# Altium project STM32F405_KIT.PrjPcb
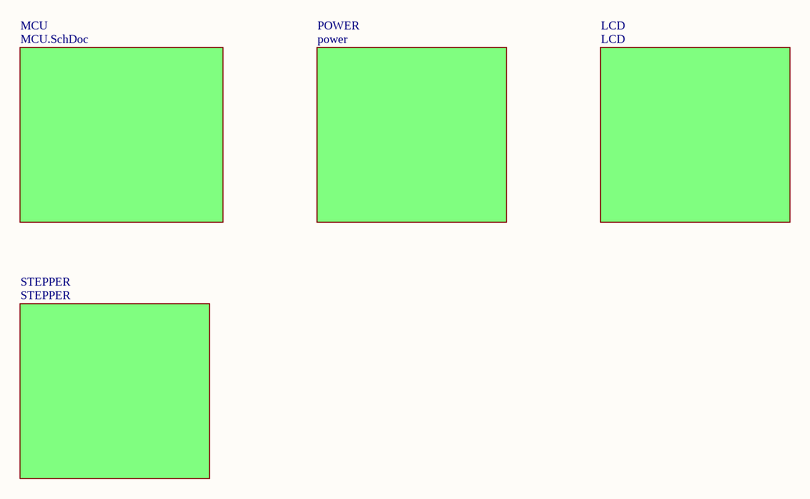
[diagram p0: MAIN.SchDoc]
4 sheets, 70 parts. Net scope: flat (ports and power ports of the same name join across sheets).
Board file: Board.PcbDoc
Sheets:
  MAIN.SchDoc
    MCU = MCU.SchDoc
    POWER = power.SchDoc
    STEPPER = STEPPER.SchDoc

## Sheet MAIN.SchDoc
size A

### Sub-sheets
LCD = LCD (file not in this document): no entries
MCU = MCU.SchDoc: no entries
POWER = power: no entries
STEPPER = STEPPER: no entries

## Sheet MCU.SchDoc
size A
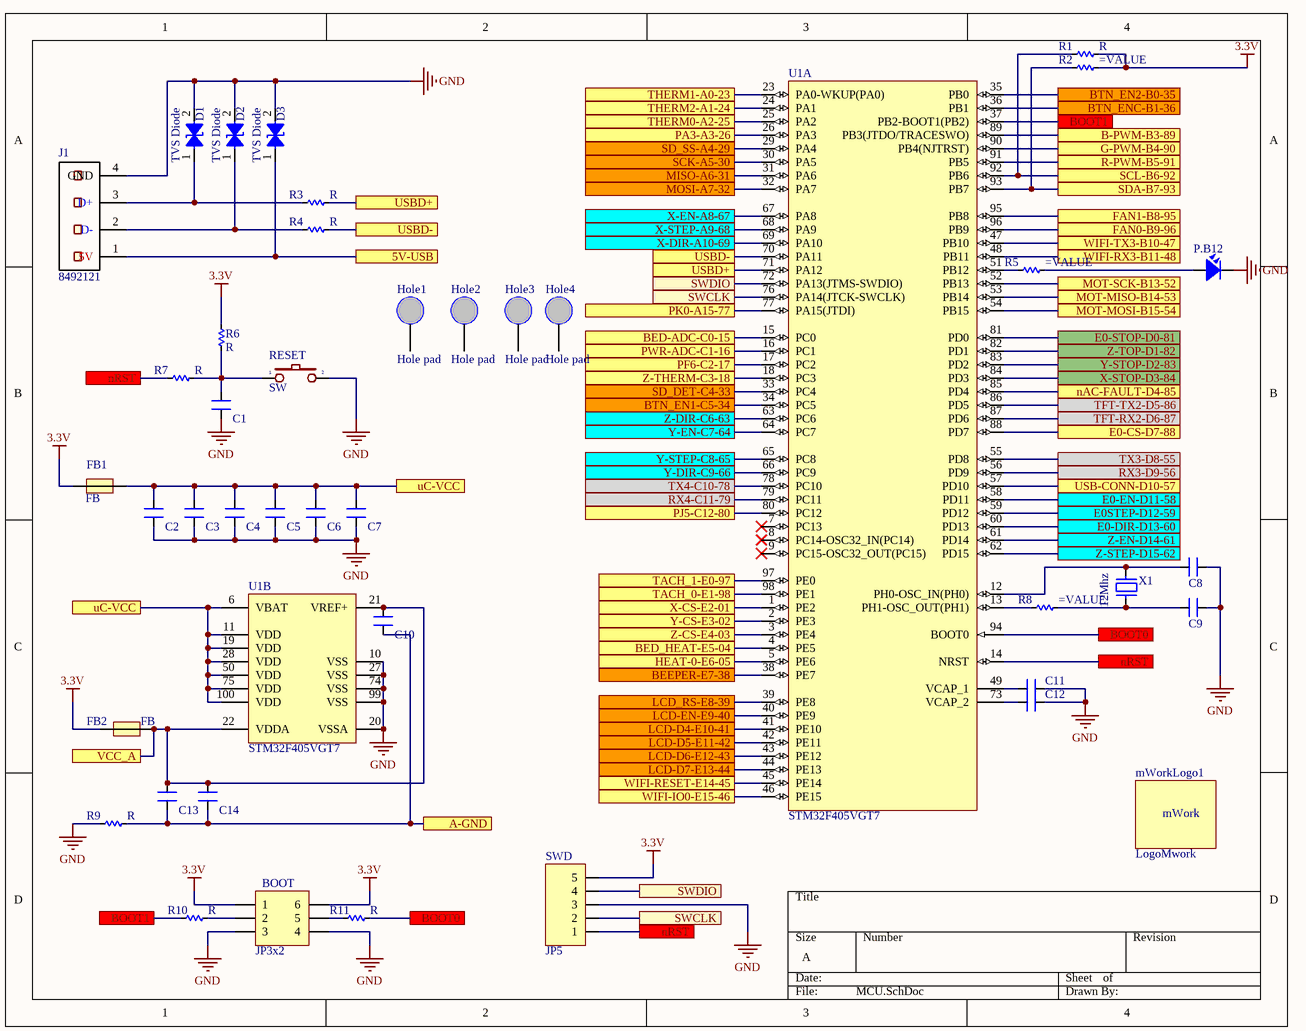
[diagram p1: MCU.SchDoc]

### Parts
BOOT  JP3x2  [JP3-D2T]
C1  CN  [CN-SMD-0603_big]  (value not drawn)
C2  CN  [CN-SMD-0603_big]  (value not drawn)
C3  CN  [CN-SMD-0603_big]  (value not drawn)
C4  CN  [CN-SMD-0603_big]  (value not drawn)
C5  CN  [CN-SMD-0603_big]  (value not drawn)
C6  CN  [CN-SMD-0603_big]  (value not drawn)
C7  CN  [CN-SMD-0603_big]  (value not drawn)
C8  CN  [CN-SMD-0603_big]  (value not drawn)
C9  CN  [CN-SMD-0603_big]  (value not drawn)
C10  CN  [CN-SMD-0603_big]  (value not drawn)
C11  CN  [CN-SMD-0603_big]  (value not drawn)
C12  CN  [CN-SMD-0603_big]  (value not drawn)
C13  CN  [CN-SMD-0603_big]  (value not drawn)
C14  CN  [CN-SMD-0603_big]  (value not drawn)
D1  TVS Diode  [DIO-SMD-214AC]
D2  TVS Diode  [DIO-SMD-214AC]
D3  TVS Diode  [DIO-SMD-214AC]
FB1  FB  [Capacitor_805]
FB2  FB  [Capacitor_805]
Hole1  Hole pad  [HolePad1]
Hole2  Hole pad  [HolePad1]
Hole3  Hole pad  [HolePad1]
Hole4  Hole pad  [HolePad1]
J1  8492121  [USB-C2]
mWorkLogo1  LogoMwork  [LogoMwork15*6]
P.B12  LED  [LED-RED-0805]  (value not drawn)
R1  R  [RES-SMD-0603_BIG]
R2  (no value)  [RES-SMD-0603_BIG]
R3  R  [RES-SMD-0603_BIG]
R4  R  [RES-SMD-0603_BIG]
R5  (no value)  [RES-SMD-0603_BIG]
R6  R  [RES-SMD-0603_BIG]
R7  R  [RES-SMD-0603_BIG]
R8  (no value)  [RES-SMD-0603_BIG]
R9  R  [RES-SMD-0603_BIG]
R10  R  [RES-SMD-0603_BIG]
R11  R  [RES-SMD-0603_BIG]
RESET  SW  [SW1-SMD]
SWD  JP5  [JP5-D1T]
U1  STM32F405VGT7  [STM-LQFP100_N]  (parts A,B of 2)
X1  12Mhz  [XT2]

### Ports
5V-USB, A-GND, B-PWM-B3-89, BED-ADC-C0-15, BED_HEAT-E5-04, BEEPER-E7-38, BOOT0, BOOT1, BTN_EN1-C5-34, BTN_EN2-B0-35, BTN_ENC-B1-36, E0-CS-D7-88, E0-DIR-D13-60, E0-EN-D11-58, E0-STOP-D0-81, E0STEP-D12-59, FAN0-B9-96, FAN1-B8-95, G-PWM-B4-90, HEAT-0-E6-05, LCD-D4-E10-41, LCD-D5-E11-42, LCD-D6-E12-43, LCD-D7-E13-44, LCD-EN-E9-40, LCD_RS-E8-39, MISO-A6-31, MOSI-A7-32, MOT-MISO-B14-53, MOT-MOSI-B15-54, MOT-SCK-B13-52, nAC-FAULT-D4-85, nRST, PA3-A3-26, PF6-C2-17, PJ5-C12-80, PK0-A15-77, PWR-ADC-C1-16, R-PWM-B5-91, RX3-D9-56, RX4-C11-79, SCK-A5-30, SCL-B6-92, SD_DET-C4-33, SD_SS-A4-29, SDA-B7-93, SWCLK, SWDIO, TACH_0-E1-98, TACH_1-E0-97, TFT-RX2-D6-87, TFT-TX2-D5-86, THERM0-A2-25, THERM1-A0-23, THERM2-A1-24, TX3-D8-55, TX4-C10-78, uC-VCC, USB-CONN-D10-57, USBD+, USBD-, VCC_A, WIFI-IO0-E15-46, WIFI-RESET-E14-45, WIFI-RX3-B11-48, WIFI-TX3-B10-47, X-CS-E2-01, X-DIR-A10-69, X-EN-A8-67, X-STEP-A9-68, X-STOP-D3-84, Y-CS-E3-02, Y-DIR-C9-66, Y-EN-C7-64, Y-STEP-C8-65, Y-STOP-D2-83, Z-CS-E4-03, Z-DIR-C6-63, Z-EN-D14-61, Z-STEP-D15-62, Z-THERM-C3-18, Z-TOP-D1-82

### Nets
3.3V: BOOT.1 BOOT.6 FB1.1 FB2.1 R1.2 R2.2 R6.1 SWD.5
GND: BOOT.3 BOOT.4 C1.1 C2.1 C3.1 C4.1 C5.1 C6.1 C7.1 C8.2 C9.2 C11.2 C12.2 D1.2(GND) D2.2(GND) D3.2(GND) J1.4(GND) P.B12.2 R9.2 RESET.2 SWD.3 U1.10(VSS) U1.20(VSSA) U1.27(VSS) U1.74(VSS) U1.99(VSS)
NetBOOT_2: BOOT.2 R10.1
NetBOOT_5: BOOT.5 R11.2
NetC1_2: C1.2 R6.2 R7.1 RESET.1
NetC2_2: C2.2 C3.2 C4.2 C5.2 C6.2 C7.2 FB1.2 U1.6(VBAT) U1.11(VDD) U1.19(VDD) U1.28(VDD) U1.50(VDD) U1.75(VDD) U1.100(VDD) ; port uC-VCC
NetC8_1: C8.1 U1.12(PH0-OSC_IN(PH0)) X1.2
NetC9_1: C9.1 R8.2 X1.1
NetC10_1: C10.1 C13.1 C14.1 R9.1 ; port A-GND
NetC10_2: C10.2 C13.2 C14.2 FB2.2 U1.21(VREF+) U1.22(VDDA) ; port VCC_A
NetC11_1: C11.1 U1.49(VCAP_1)
NetC12_1: C12.1 U1.73(VCAP_2)
NetC21_3: R7.2 SWD.1 U1.14(NRST) ; port nRST
NetC21_4: U1.78(PC10) ; port TX4-C10-78
NetC21_5: U1.80(PC12) ; port PJ5-C12-80
NetC21_6: U1.82(PD1) ; port Z-TOP-D1-82
NetC21_7: U1.84(PD3) ; port X-STOP-D3-84
NetC21_8: U1.86(PD5) ; port TFT-TX2-D5-86
NetC21_9: U1.88(PD7) ; port E0-CS-D7-88
NetC21_10: U1.90(PB4(NJTRST)) ; port G-PWM-B4-90
NetC21_11: R1.1 U1.92(PB6) ; port SCL-B6-92
NetC21_13: U1.96(PB9) ; port FAN0-B9-96
NetC21_14: U1.98(PE1) ; port TACH_0-E1-98
NetC21_15: U1.2(PE3) ; port Y-CS-E3-02
NetC21_16: U1.4(PE5) ; port BED_HEAT-E5-04
NetC21_18: U1.16(PC1) ; port PWR-ADC-C1-16
NetC21_19: U1.18(PC3) ; port Z-THERM-C3-18
NetC21_21: U1.24(PA1) ; port THERM2-A1-24
NetC21_22: U1.26(PA3) ; port PA3-A3-26
NetC21_23: U1.25(PA2) ; port THERM0-A2-25
NetC21_24: U1.23(PA0-WKUP(PA0)) ; port THERM1-A0-23
NetC21_26: U1.17(PC2) ; port PF6-C2-17
NetC21_27: U1.15(PC0) ; port BED-ADC-C0-15
NetC21_28: U1.5(PE6) ; port HEAT-0-E6-05
NetC21_29: U1.3(PE4) ; port Z-CS-E4-03
NetC21_30: U1.1(PE2) ; port X-CS-E2-01
NetC21_31: U1.97(PE0) ; port TACH_1-E0-97
NetC21_32: U1.95(PB8) ; port FAN1-B8-95
NetC21_33: R2.1 U1.93(PB7) ; port SDA-B7-93
NetC21_34: U1.91(PB5) ; port R-PWM-B5-91
NetC21_35: U1.89(PB3(JTDO/TRACESWO)) ; port B-PWM-B3-89
NetC21_36: U1.87(PD6) ; port TFT-RX2-D6-87
NetC21_37: U1.85(PD4) ; port nAC-FAULT-D4-85
NetC21_38: U1.83(PD2) ; port Y-STOP-D2-83
NetC21_39: U1.81(PD0) ; port E0-STOP-D0-81
NetC21_40: U1.79(PC11) ; port RX4-C11-79
NetC21_41: U1.77(PA15(JTDI)) ; port PK0-A15-77
NetC22_3: U1.68(PA9) ; port X-STEP-A9-68
NetC22_4: U1.66(PC9) ; port Y-DIR-C9-66
NetC22_5: U1.64(PC7) ; port Y-EN-C7-64
NetC22_6: U1.62(PD15) ; port Z-STEP-D15-62
NetC22_7: U1.60(PD13) ; port E0-DIR-D13-60
NetC22_8: U1.58(PD11) ; port E0-EN-D11-58
NetC22_9: U1.56(PD9) ; port RX3-D9-56
NetC22_10: U1.54(PB15) ; port MOT-MOSI-B15-54
NetC22_11: U1.52(PB13) ; port MOT-SCK-B13-52
NetC22_12: U1.47(PB10) ; port WIFI-TX3-B10-47
NetC22_13: U1.45(PE14) ; port WIFI-RESET-E14-45
NetC22_16: U1.43(PE12) ; port LCD-D6-E12-43
NetC22_17: U1.41(PE10) ; port LCD-D4-E10-41
NetC22_18: U1.39(PE8) ; port LCD_RS-E8-39
NetC22_19: U1.36(PB1) ; port BTN_ENC-B1-36
NetC22_20: U1.34(PC5) ; port BTN_EN1-C5-34
NetC22_21: U1.32(PA7) ; port MOSI-A7-32
NetC22_22: U1.30(PA5) ; port SCK-A5-30
NetC22_23: U1.29(PA4) ; port SD_SS-A4-29
NetC22_24: U1.31(PA6) ; port MISO-A6-31
NetC22_25: U1.33(PC4) ; port SD_DET-C4-33
NetC22_26: U1.35(PB0) ; port BTN_EN2-B0-35
NetC22_27: U1.38(PE7) ; port BEEPER-E7-38
NetC22_28: U1.40(PE9) ; port LCD-EN-E9-40
NetC22_29: U1.42(PE11) ; port LCD-D5-E11-42
NetC22_30: U1.44(PE13) ; port LCD-D7-E13-44
NetC22_32: U1.46(PE15) ; port WIFI-IO0-E15-46
NetC22_33: U1.48(PB11) ; port WIFI-RX3-B11-48
NetC22_34: U1.53(PB14) ; port MOT-MISO-B14-53
NetC22_35: U1.55(PD8) ; port TX3-D8-55
NetC22_36: U1.57(PD10) ; port USB-CONN-D10-57
NetC22_37: U1.59(PD12) ; port E0STEP-D12-59
NetC22_38: U1.61(PD14) ; port Z-EN-D14-61
NetC22_39: U1.63(PC6) ; port Z-DIR-C6-63
NetC22_40: U1.65(PC8) ; port Y-STEP-C8-65
NetC22_41: U1.67(PA8) ; port X-EN-A8-67
NetC22_42: U1.69(PA10) ; port X-DIR-A10-69
NetD1_1: D1.1(I/O_1) J1.3(D+) R3.2
NetD2_1: D2.1(I/O_1) J1.2(D-) R4.2
NetD3_1: D3.1(I/O_1) J1.1(5V) ; port 5V-USB
NetP.B12_1: P.B12.1 R5.2
NetR3_1: R3.1 U1.71(PA12) ; port USBD+
NetR4_1: R4.1 U1.70(PA11) ; port USBD-
NetR5_1: R5.1 U1.51(PB12)
NetR8_1: R8.1 U1.13(PH1-OSC_OUT(PH1))
NetR10_2: R10.2 U1.37(PB2-BOOT1(PB2)) ; port BOOT1
NetR11_1: R11.1 U1.94(BOOT0) ; port BOOT0
NetSWD_2: SWD.2 U1.76(PA14(JTCK-SWCLK)) ; port SWCLK
NetSWD_4: SWD.4 U1.72(PA13(JTMS-SWDIO)) ; port SWDIO

Not connected (* = marked no-connect by the designer): Hole1 1; Hole2 1; Hole3 1; Hole4 1; U1 7(PC13)* 8(PC14-OSC32_IN(PC14))* 9(PC15-OSC32_OUT(PC15))*

### Notes on the sheet
- (in symbol LogoMwork) mWork

### Library data of the parts
BOOT = JP3x2: WR-PHD 2.54 mm Dual Socket Header; Manufacturer: W¨¹rth Elektronik eiSos GmbH; partNo: 61300621821; ComponentLink1 Description: Manufacturer; ComponentLink2 Description: Datasheet; NoPins: 06; Created Date: 29 March 2013; ComponentLink1URL: http://www.we-online.com; ComponentLink2URL: http://katalog.we-online.de/em/datasheet/6130xx21821.pdf; Created by: Karrer Zheng
C1-C14 = CN: Value: 33pF
D1-D3 = TVS Diode: SMAJ5.0A
J1 = USB-4: THT USB 2.0 A Connector WE-EPLE; Manufacturer: Würth Elektronik eiSos GmbH; PartNo: 8492121; ComponentLink1Description: Manufacturer; ComponentLink1URL: http://www.we-online.de; Created by: Christin Otto; Created Date: OCT-2014; ComponentLink2Description: Datasheet; ComponentLink2URL: http://www.we-online.de/katalog/media/pdf/8492121.pdf
P.B12 = LED SMD: Value: LED 3 - 5 ly 2 Colour
R2 R5 R8 = R: Parameter 1: *
RESET = SW2: Switch button 2 pin; Value: SW chip 2 pin
SWD = JP5: WR-PHD 2.54 mm Angled Socket Header; Manufacturer: W¨¹rth Elektronik eiSos GmbH; partNo: 613005143121; ComponentLink1 Description: Manufacturer; ComponentLink2 Description: Datasheet; NoPins: 05; Created Date: 29 March 2013; ComponentLink1URL: http://www.we-online.com; ComponentLink2URL: http://katalog.we-online.de/em/datasheet/6130xx143121.pdf; Created by: Karrer Zheng
U1 = STM32F405VGT7: ARM Cortex-M4 32-bit MCU+FPU, 210 DMIPS, 1024 kB Flash, 192 kB Internal RAM, 82 I/Os, 100-pin LQFP, -40 to 105 degC, Tray; Manufacturer: STMicroelectronics; D/A Converter: 2x12-bit; FLASH Size (Prog) (kB): 1024; I/Os (High Current): 82; Internal RAM Size (kB): 192; Operating Frequency(F) (Processor speed) (MHz): 168; Supply Voltage(Vcc) max (V): 3.6; Supply Voltage(Vcc) min (V): 1.8; DatasheetVersion: Rev. 4; PackageVersion: Rev. 1, 06/2013; PackageReference: LQFP100; PackageDescription: 100-Pin Low Profile Quad Flat Package, 14 x 14 mm Body, 0.5 mm Pitch; Supplier 1: Newark; Supplier Part Number 1: 19X6225; Supplier 2: Mouser; Supplier Part Number 2: 511-STM32F405VGT7; Core: ARM Cortex-M4; Packing: Tray; Mounting Technology: Surface Mount; PartNumber: STM32F405VGT7; ComponentLink1Description: Manufacturer URL; ComponentLink1URL: http://www.st.com/web/en/home.html; ComponentLink2Description: Datasheet; ComponentLink2URL: http://www.st.com/st-web-ui/static/active/en/resource/technical/document/datasheet/DM00037051.pdf; ComponentLink3Description: Package Specification; ComponentLink3URL: http://www.st.com/st-web-ui/static/active/en/resource/technical/document/data_brief/DM00071938.pdf
X1 = XT2: Crystal, 32.768 KHz, -40 to 85 degC, 3.2 x 1.5 x 0.9 mm SMD; Value: 4Mhz

## Sheet power.SchDoc
size A
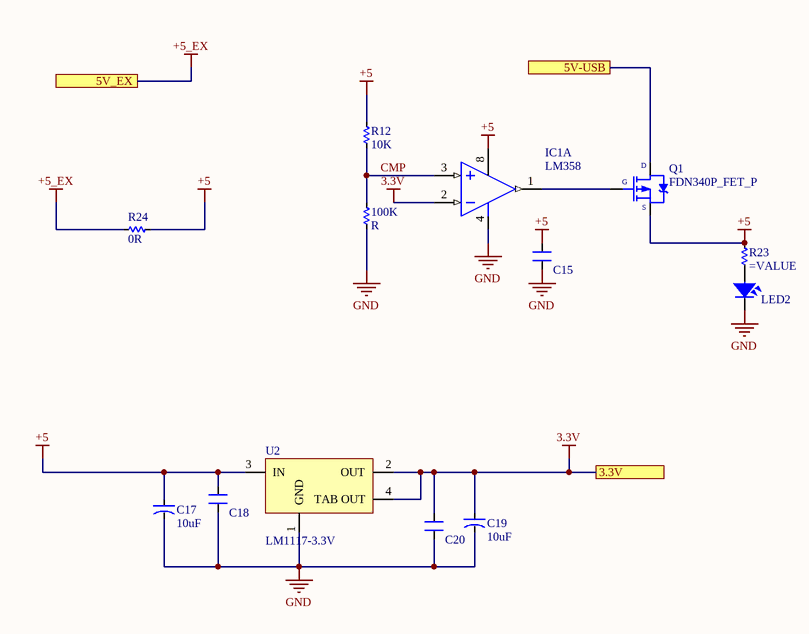
[diagram p2: power.SchDoc]

### Parts
100K  R  [RES-SMD-0603_BIG]
C15  CN  [CN-SMD-0603_big]  (value not drawn)
C17  10uF  [CAP-ALU-SMD-6.3x7.7x2.2]
C18  CN  [CN-SMD-0603_big]  (value not drawn)
C19  10uF  [CAP-ALU-SMD-6.3x7.7x2.2]
C20  CN  [CN-SMD-0603_big]  (value not drawn)
IC1  LM358  [SO8]  (part A of 2)
LED2  LED  [LED-RED-0805]  (value not drawn)
Q1  FDN340P_FET_P  [SOT23F]
R12  10K  [RES-SMD-0603_BIG]
R23  (no value)  [RES-SMD-0603_BIG]
R24  0R  [RES-SMD-0603_BIG]
U2  LM1117-3.3V  [SOT223]

### Ports
3.3V, 5V-USB, 5V_EX

### Nets
3.3V: C19.1 C20.2 IC1.2(IN-) U2.2(OUT) U2.4(TAB_OUT) ; port 3.3V
+5: C15.2 C17.1 C18.2 IC1.8(+V) Q1.2(S) R12.1 R23.1 R24.2 U2.3(IN)
+5_EX: R24.1 ; port 5V_EX
GND: 100K.2 C15.1 C17.2 C18.1 C19.2 C20.1 IC1.4(-V) LED2.2 U2.1(GND)
CMP: 100K.1 IC1.3(IN+) R12.2
NetD3_1: Q1.3(D) ; port 5V-USB
NetIC1_1: IC1.1(OUT) Q1.1(G)
NetLED2_1: LED2.1 R23.2

### Library data of the parts
C15 C18 C20 = CN: Value: 33pF
C17 C19 = CN-ALU-SMD: Polarized Capacitor (Axial); Published: 8-Jun-2000; LatestRevisionDate: 17-Jul-2002; LatestRevisionNote: Re-released for DXP Platform.; PackageReference: POLAR0.8; Publisher: Altium Limited
IC1 = LM358: Low-Power Dual Operational Amplifier; Value: LM358
LED2 = LED SMD: Value: LED 3 - 5 ly 2 Colour
Q1 = FDN340P_FET_P: P-Channel, 20V, 2A; Value: IRF840
R12 R23 R24 = R
  R23: Parameter 1: *
U2 = LM1117: 800mA Low-Dropout Linear Regulator; Creator: Nguyen Ba Bien; Website: http://group3i.net

## Sheet STEPPER.SchDoc
size A
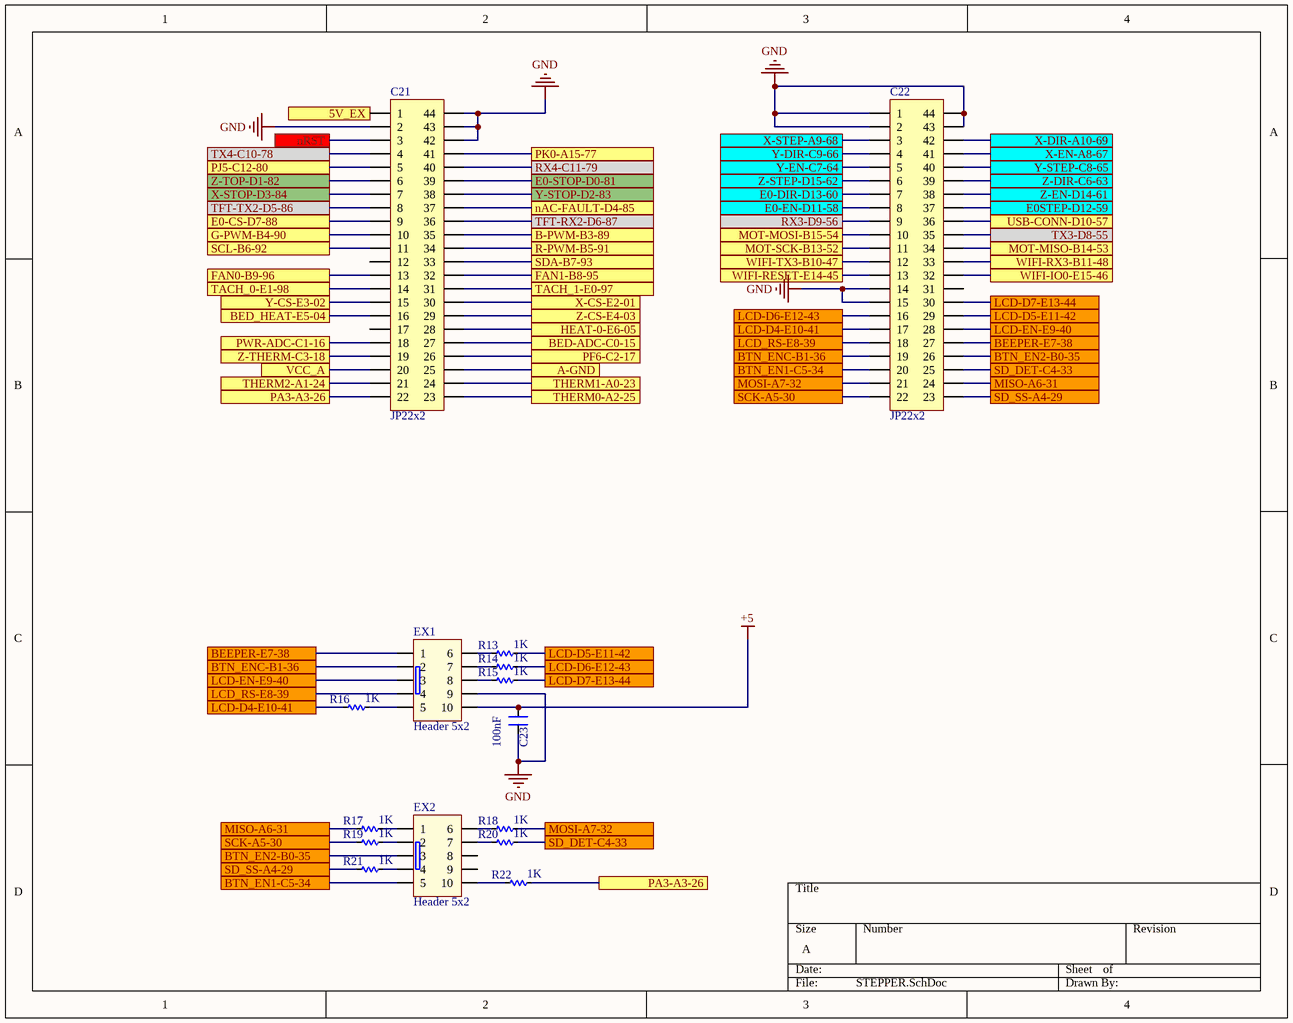
[diagram p3: STEPPER.SchDoc]

### Parts
C21  JP22x2  [JP22-C2T]
C22  JP22x2  [JP22-C2T]
C23  100nF  [CN-SMD-0603_big]
EX1  Header 5x2  [Hed2X5]
EX2  Header 5x2  [Hed2X5]
R13  1K  [RES-SMD-0603_BIG]
R14  1K  [RES-SMD-0603_BIG]
R15  1K  [RES-SMD-0603_BIG]
R16  1K  [RES-SMD-0603_BIG]
R17  1K  [RES-SMD-0603_BIG]
R18  1K  [RES-SMD-0603_BIG]
R19  1K  [RES-SMD-0603_BIG]
R20  1K  [RES-SMD-0603_BIG]
R21  1K  [RES-SMD-0603_BIG]
R22  1K  [RES-SMD-0603_BIG]

### Ports
5V_EX, A-GND, B-PWM-B3-89, BED-ADC-C0-15, BED_HEAT-E5-04, BEEPER-E7-38, BTN_EN1-C5-34, BTN_EN2-B0-35, BTN_ENC-B1-36, E0-CS-D7-88, E0-DIR-D13-60, E0-EN-D11-58, E0-STOP-D0-81, E0STEP-D12-59, FAN0-B9-96, FAN1-B8-95, G-PWM-B4-90, HEAT-0-E6-05, LCD-D4-E10-41, LCD-D5-E11-42, LCD-D6-E12-43, LCD-D7-E13-44, LCD-EN-E9-40, LCD_RS-E8-39, MISO-A6-31, MOSI-A7-32, MOT-MISO-B14-53, MOT-MOSI-B15-54, MOT-SCK-B13-52, nAC-FAULT-D4-85, nRST, PA3-A3-26, PF6-C2-17, PJ5-C12-80, PK0-A15-77, PWR-ADC-C1-16, R-PWM-B5-91, RX3-D9-56, RX4-C11-79, SCK-A5-30, SCL-B6-92, SD_DET-C4-33, SD_SS-A4-29, SDA-B7-93, TACH_0-E1-98, TACH_1-E0-97, TFT-RX2-D6-87, TFT-TX2-D5-86, THERM0-A2-25, THERM1-A0-23, THERM2-A1-24, TX3-D8-55, TX4-C10-78, USB-CONN-D10-57, VCC_A, WIFI-IO0-E15-46, WIFI-RESET-E14-45, WIFI-RX3-B11-48, WIFI-TX3-B10-47, X-CS-E2-01, X-DIR-A10-69, X-EN-A8-67, X-STEP-A9-68, X-STOP-D3-84, Y-CS-E3-02, Y-DIR-C9-66, Y-EN-C7-64, Y-STEP-C8-65, Y-STOP-D2-83, Z-CS-E4-03, Z-DIR-C6-63, Z-EN-D14-61, Z-STEP-D15-62, Z-THERM-C3-18, Z-TOP-D1-82

### Nets
+5: C23.2 EX1.10
+5_EX: C21.1 ; port 5V_EX
GND: C21.2 C21.42 C21.43 C21.44 C22.1 C22.2 C22.14 C22.15 C22.43 C22.44 C23.1 EX1.9
NetC10_1: C21.25 ; port A-GND
NetC10_2: C21.20 ; port VCC_A
NetC21_3: C21.3 ; port nRST
NetC21_4: C21.4 ; port TX4-C10-78
NetC21_5: C21.5 ; port PJ5-C12-80
NetC21_6: C21.6 ; port Z-TOP-D1-82
NetC21_7: C21.7 ; port X-STOP-D3-84
NetC21_8: C21.8 ; port TFT-TX2-D5-86
NetC21_9: C21.9 ; port E0-CS-D7-88
NetC21_10: C21.10 ; port G-PWM-B4-90
NetC21_11: C21.11 ; port SCL-B6-92
NetC21_13: C21.13 ; port FAN0-B9-96
NetC21_14: C21.14 ; port TACH_0-E1-98
NetC21_15: C21.15 ; port Y-CS-E3-02
NetC21_16: C21.16 ; port BED_HEAT-E5-04
NetC21_18: C21.18 ; port PWR-ADC-C1-16
NetC21_19: C21.19 ; port Z-THERM-C3-18
NetC21_21: C21.21 ; port THERM2-A1-24
NetC21_22: C21.22 R22.1 ; port PA3-A3-26
NetC21_23: C21.23 ; port THERM0-A2-25
NetC21_24: C21.24 ; port THERM1-A0-23
NetC21_26: C21.26 ; port PF6-C2-17
NetC21_27: C21.27 ; port BED-ADC-C0-15
NetC21_28: C21.28 ; port HEAT-0-E6-05
NetC21_29: C21.29 ; port Z-CS-E4-03
NetC21_30: C21.30 ; port X-CS-E2-01
NetC21_31: C21.31 ; port TACH_1-E0-97
NetC21_32: C21.32 ; port FAN1-B8-95
NetC21_33: C21.33 ; port SDA-B7-93
NetC21_34: C21.34 ; port R-PWM-B5-91
NetC21_35: C21.35 ; port B-PWM-B3-89
NetC21_36: C21.36 ; port TFT-RX2-D6-87
NetC21_37: C21.37 ; port nAC-FAULT-D4-85
NetC21_38: C21.38 ; port Y-STOP-D2-83
NetC21_39: C21.39 ; port E0-STOP-D0-81
NetC21_40: C21.40 ; port RX4-C11-79
NetC21_41: C21.41 ; port PK0-A15-77
NetC22_3: C22.3 ; port X-STEP-A9-68
NetC22_4: C22.4 ; port Y-DIR-C9-66
NetC22_5: C22.5 ; port Y-EN-C7-64
NetC22_6: C22.6 ; port Z-STEP-D15-62
NetC22_7: C22.7 ; port E0-DIR-D13-60
NetC22_8: C22.8 ; port E0-EN-D11-58
NetC22_9: C22.9 ; port RX3-D9-56
NetC22_10: C22.10 ; port MOT-MOSI-B15-54
NetC22_11: C22.11 ; port MOT-SCK-B13-52
NetC22_12: C22.12 ; port WIFI-TX3-B10-47
NetC22_13: C22.13 ; port WIFI-RESET-E14-45
NetC22_16: C22.16 R14.1 ; port LCD-D6-E12-43
NetC22_17: C22.17 R16.2 ; port LCD-D4-E10-41
NetC22_18: C22.18 EX1.4 ; port LCD_RS-E8-39
NetC22_19: C22.19 EX1.2 ; port BTN_ENC-B1-36
NetC22_20: C22.20 EX2.5 ; port BTN_EN1-C5-34
NetC22_21: C22.21 R18.1 ; port MOSI-A7-32
NetC22_22: C22.22 R19.2 ; port SCK-A5-30
NetC22_23: C22.23 R21.2 ; port SD_SS-A4-29
NetC22_24: C22.24 R17.2 ; port MISO-A6-31
NetC22_25: C22.25 R20.1 ; port SD_DET-C4-33
NetC22_26: C22.26 EX2.3 ; port BTN_EN2-B0-35
NetC22_27: C22.27 EX1.1 ; port BEEPER-E7-38
NetC22_28: C22.28 EX1.3 ; port LCD-EN-E9-40
NetC22_29: C22.29 R13.1 ; port LCD-D5-E11-42
NetC22_30: C22.30 R15.1 ; port LCD-D7-E13-44
NetC22_32: C22.32 ; port WIFI-IO0-E15-46
NetC22_33: C22.33 ; port WIFI-RX3-B11-48
NetC22_34: C22.34 ; port MOT-MISO-B14-53
NetC22_35: C22.35 ; port TX3-D8-55
NetC22_36: C22.36 ; port USB-CONN-D10-57
NetC22_37: C22.37 ; port E0STEP-D12-59
NetC22_38: C22.38 ; port Z-EN-D14-61
NetC22_39: C22.39 ; port Z-DIR-C6-63
NetC22_40: C22.40 ; port Y-STEP-C8-65
NetC22_41: C22.41 ; port X-EN-A8-67
NetC22_42: C22.42 ; port X-DIR-A10-69
NetEX1_5: EX1.5 R16.1
NetEX1_6: EX1.6 R13.2
NetEX1_7: EX1.7 R14.2
NetEX1_8: EX1.8 R15.2
NetEX2_1: EX2.1 R17.1
NetEX2_2: EX2.2 R19.1
NetEX2_4: EX2.4 R21.1
NetEX2_6: EX2.6 R18.2
NetEX2_7: EX2.7 R20.2
NetEX2_10: EX2.10 R22.2

Not connected (* = marked no-connect by the designer): C21 12 17; C22 31; EX2 8 9

### Library data of the parts
C21 C22 = JP22x2: WR-PHD 2.54 mm Dual Socket Header; Manufacturer: W¨¹rth Elektronik eiSos GmbH; partNo: 61304421821; ComponentLink1 Description: Manufacturer; ComponentLink2 Description: Datasheet; NoPins: 44; Created Date: 29 March 2013; ComponentLink1URL: http://www.we-online.com; ComponentLink2URL: http://katalog.we-online.de/em/datasheet/6130xx21821.pdf; Created by: Karrer Zheng
C23 = CN: Value: 33pF
EX1 EX2 = HED5x2: Value: Header 5x2
R13-R22 = R

## Nets that join several sheets
3.3V: MCU (8 pins), power (5 pins)
+5: power (9 pins), STEPPER (C23.2 EX1.10)
+5_EX: power (R24.1), STEPPER (C21.1)
GND: MCU (26 pins), power (9 pins), STEPPER (12 pins)
NetC10_1: MCU (C10.1 C13.1 C14.1 R9.1), STEPPER (C21.25)
NetC10_2: MCU (6 pins), STEPPER (C21.20)
NetC21_3: MCU (R7.2 SWD.1 U1.14), STEPPER (C21.3)
NetC21_4: MCU (U1.78), STEPPER (C21.4)
NetC21_5: MCU (U1.80), STEPPER (C21.5)
NetC21_6: MCU (U1.82), STEPPER (C21.6)
NetC21_7: MCU (U1.84), STEPPER (C21.7)
NetC21_8: MCU (U1.86), STEPPER (C21.8)
NetC21_9: MCU (U1.88), STEPPER (C21.9)
NetC21_10: MCU (U1.90), STEPPER (C21.10)
NetC21_11: MCU (R1.1 U1.92), STEPPER (C21.11)
NetC21_13: MCU (U1.96), STEPPER (C21.13)
NetC21_14: MCU (U1.98), STEPPER (C21.14)
NetC21_15: MCU (U1.2), STEPPER (C21.15)
NetC21_16: MCU (U1.4), STEPPER (C21.16)
NetC21_18: MCU (U1.16), STEPPER (C21.18)
NetC21_19: MCU (U1.18), STEPPER (C21.19)
NetC21_21: MCU (U1.24), STEPPER (C21.21)
NetC21_22: MCU (U1.26), STEPPER (C21.22 R22.1)
NetC21_23: MCU (U1.25), STEPPER (C21.23)
NetC21_24: MCU (U1.23), STEPPER (C21.24)
NetC21_26: MCU (U1.17), STEPPER (C21.26)
NetC21_27: MCU (U1.15), STEPPER (C21.27)
NetC21_28: MCU (U1.5), STEPPER (C21.28)
NetC21_29: MCU (U1.3), STEPPER (C21.29)
NetC21_30: MCU (U1.1), STEPPER (C21.30)
NetC21_31: MCU (U1.97), STEPPER (C21.31)
NetC21_32: MCU (U1.95), STEPPER (C21.32)
NetC21_33: MCU (R2.1 U1.93), STEPPER (C21.33)
NetC21_34: MCU (U1.91), STEPPER (C21.34)
NetC21_35: MCU (U1.89), STEPPER (C21.35)
NetC21_36: MCU (U1.87), STEPPER (C21.36)
NetC21_37: MCU (U1.85), STEPPER (C21.37)
NetC21_38: MCU (U1.83), STEPPER (C21.38)
NetC21_39: MCU (U1.81), STEPPER (C21.39)
NetC21_40: MCU (U1.79), STEPPER (C21.40)
NetC21_41: MCU (U1.77), STEPPER (C21.41)
NetC22_3: MCU (U1.68), STEPPER (C22.3)
NetC22_4: MCU (U1.66), STEPPER (C22.4)
NetC22_5: MCU (U1.64), STEPPER (C22.5)
NetC22_6: MCU (U1.62), STEPPER (C22.6)
NetC22_7: MCU (U1.60), STEPPER (C22.7)
NetC22_8: MCU (U1.58), STEPPER (C22.8)
NetC22_9: MCU (U1.56), STEPPER (C22.9)
NetC22_10: MCU (U1.54), STEPPER (C22.10)
NetC22_11: MCU (U1.52), STEPPER (C22.11)
NetC22_12: MCU (U1.47), STEPPER (C22.12)
NetC22_13: MCU (U1.45), STEPPER (C22.13)
NetC22_16: MCU (U1.43), STEPPER (C22.16 R14.1)
NetC22_17: MCU (U1.41), STEPPER (C22.17 R16.2)
NetC22_18: MCU (U1.39), STEPPER (C22.18 EX1.4)
NetC22_19: MCU (U1.36), STEPPER (C22.19 EX1.2)
NetC22_20: MCU (U1.34), STEPPER (C22.20 EX2.5)
NetC22_21: MCU (U1.32), STEPPER (C22.21 R18.1)
NetC22_22: MCU (U1.30), STEPPER (C22.22 R19.2)
NetC22_23: MCU (U1.29), STEPPER (C22.23 R21.2)
NetC22_24: MCU (U1.31), STEPPER (C22.24 R17.2)
NetC22_25: MCU (U1.33), STEPPER (C22.25 R20.1)
NetC22_26: MCU (U1.35), STEPPER (C22.26 EX2.3)
NetC22_27: MCU (U1.38), STEPPER (C22.27 EX1.1)
NetC22_28: MCU (U1.40), STEPPER (C22.28 EX1.3)
NetC22_29: MCU (U1.42), STEPPER (C22.29 R13.1)
NetC22_30: MCU (U1.44), STEPPER (C22.30 R15.1)
NetC22_32: MCU (U1.46), STEPPER (C22.32)
NetC22_33: MCU (U1.48), STEPPER (C22.33)
NetC22_34: MCU (U1.53), STEPPER (C22.34)
NetC22_35: MCU (U1.55), STEPPER (C22.35)
NetC22_36: MCU (U1.57), STEPPER (C22.36)
NetC22_37: MCU (U1.59), STEPPER (C22.37)
NetC22_38: MCU (U1.61), STEPPER (C22.38)
NetC22_39: MCU (U1.63), STEPPER (C22.39)
NetC22_40: MCU (U1.65), STEPPER (C22.40)
NetC22_41: MCU (U1.67), STEPPER (C22.41)
NetC22_42: MCU (U1.69), STEPPER (C22.42)
NetD3_1: MCU (D3.1 J1.1), power (Q1.3)